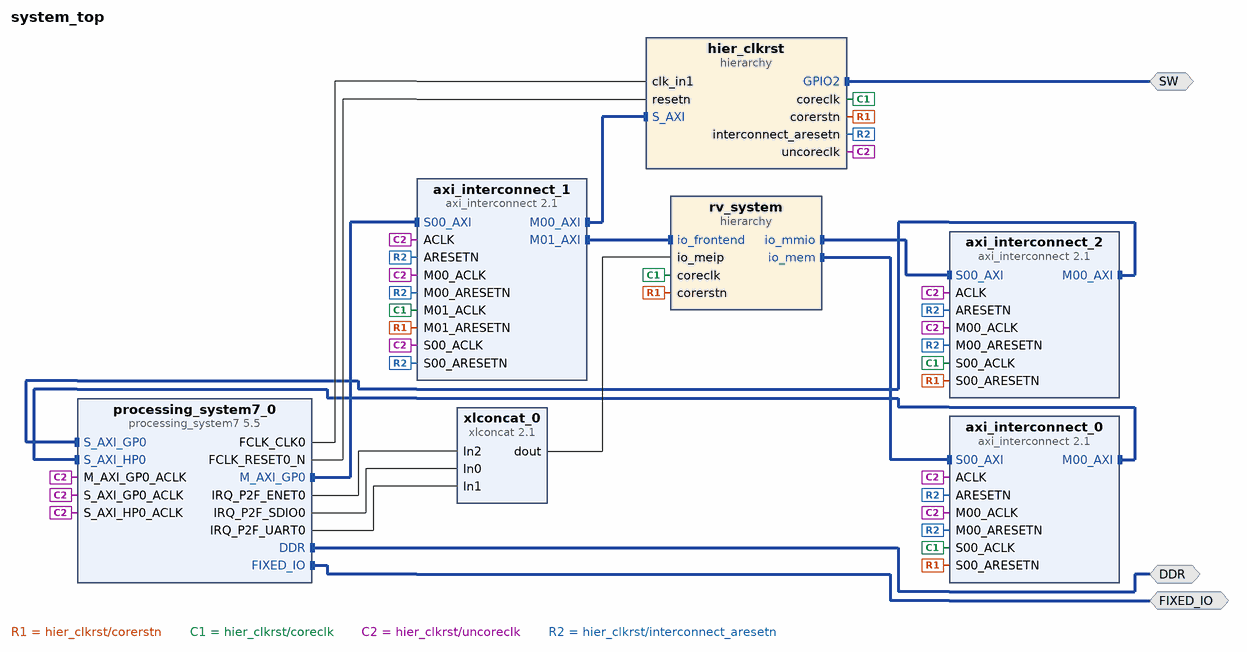
[diagram p0: block diagram of the top level]
# Vivado block design system_top, xc7z020clg400-1, Vivado 2020.2
create_bd_design system_top

create_bd_intf_port -mode Master -vlnv xilinx.com:interface:ddrx_rtl:1.0 DDR
create_bd_intf_port -mode Master -vlnv xilinx.com:display_processing_system7:fixedio_rtl:1.0 FIXED_IO
create_bd_intf_port -mode Master -vlnv xilinx.com:interface:gpio_rtl:1.0 SW

create_bd_cell -type ip -vlnv xilinx.com:ip:axi_interconnect:2.1 axi_interconnect_0
set_property -dict {CONFIG.NUM_MI 1 CONFIG.NUM_SI 1} [get_bd_cells axi_interconnect_0]
create_bd_cell -type ip -vlnv xilinx.com:ip:axi_interconnect:2.1 axi_interconnect_1
set_property -dict {CONFIG.NUM_MI 2} [get_bd_cells axi_interconnect_1]
create_bd_cell -type ip -vlnv xilinx.com:ip:axi_interconnect:2.1 axi_interconnect_2
set_property -dict {CONFIG.NUM_MI 1 CONFIG.NUM_SI 1} [get_bd_cells axi_interconnect_2]
create_bd_cell -type hier hier_clkrst
create_bd_cell -type ip -vlnv xilinx.com:ip:processing_system7:5.5 processing_system7_0
set_property -dict [list \
  CONFIG.PCW_APU_PERIPHERAL_FREQMHZ 650 \
  CONFIG.PCW_CRYSTAL_PERIPHERAL_FREQMHZ 50 \
  CONFIG.PCW_ENET0_ENET0_IO {MIO 16 .. 27} \
  CONFIG.PCW_ENET0_GRP_MDIO_ENABLE 1 \
  CONFIG.PCW_ENET0_GRP_MDIO_IO {MIO 52 .. 53} \
  CONFIG.PCW_ENET0_PERIPHERAL_ENABLE 1 \
  CONFIG.PCW_ENET0_RESET_ENABLE 1 \
  CONFIG.PCW_ENET0_RESET_IO {MIO 9} \
  CONFIG.PCW_ENET_RESET_ENABLE 1 \
  CONFIG.PCW_ENET_RESET_SELECT {Share reset pin} \
  CONFIG.PCW_FPGA0_PERIPHERAL_FREQMHZ 100 \
  CONFIG.PCW_FPGA1_PERIPHERAL_FREQMHZ 50 \
  CONFIG.PCW_GPIO_MIO_GPIO_ENABLE 1 \
  CONFIG.PCW_GPIO_MIO_GPIO_IO MIO \
  CONFIG.PCW_I2C_RESET_ENABLE 1 \
  CONFIG.PCW_M_AXI_GP0_ENABLE_STATIC_REMAP 1 \
  CONFIG.PCW_M_AXI_GP0_THREAD_ID_WIDTH 6 \
  CONFIG.PCW_P2F_ENET0_INTR 1 \
  CONFIG.PCW_P2F_SDIO0_INTR 1 \
  CONFIG.PCW_P2F_UART0_INTR 1 \
  CONFIG.PCW_PERIPHERAL_BOARD_PRESET part0 \
  CONFIG.PCW_PRESET_BANK1_VOLTAGE {LVCMOS 1.8V} \
  CONFIG.PCW_QSPI_GRP_FBCLK_ENABLE 1 \
  CONFIG.PCW_QSPI_GRP_FBCLK_IO {MIO 8} \
  CONFIG.PCW_QSPI_GRP_SINGLE_SS_ENABLE 1 \
  CONFIG.PCW_QSPI_GRP_SINGLE_SS_IO {MIO 1 .. 6} \
  CONFIG.PCW_QSPI_PERIPHERAL_ENABLE 1 \
  CONFIG.PCW_QSPI_QSPI_IO {MIO 1 .. 6} \
  CONFIG.PCW_SD0_GRP_CD_ENABLE 1 \
  CONFIG.PCW_SD0_GRP_CD_IO {MIO 47} \
  CONFIG.PCW_SD0_GRP_WP_ENABLE 0 \
  CONFIG.PCW_SD0_PERIPHERAL_ENABLE 1 \
  CONFIG.PCW_SD0_SD0_IO {MIO 40 .. 45} \
  CONFIG.PCW_SDIO_PERIPHERAL_FREQMHZ 50 \
  CONFIG.PCW_SINGLE_QSPI_DATA_MODE x4 \
  CONFIG.PCW_UART0_PERIPHERAL_ENABLE 1 \
  CONFIG.PCW_UART0_UART0_IO {MIO 14 .. 15} \
  CONFIG.PCW_UART1_PERIPHERAL_ENABLE 0 \
  CONFIG.PCW_UART_PERIPHERAL_FREQMHZ 100 \
  CONFIG.PCW_UIPARAM_DDR_BUS_WIDTH {16 Bit} \
  CONFIG.PCW_UIPARAM_DDR_FREQ_MHZ 525 \
  CONFIG.PCW_UIPARAM_DDR_PARTNO {MT41J256M16 RE-125} \
  CONFIG.PCW_USB0_PERIPHERAL_ENABLE 1 \
  CONFIG.PCW_USB0_RESET_ENABLE 1 \
  CONFIG.PCW_USB0_RESET_IO {MIO 46} \
  CONFIG.PCW_USB0_USB0_IO {MIO 28 .. 39} \
  CONFIG.PCW_USB_RESET_ENABLE 1 \
  CONFIG.PCW_USB_RESET_SELECT {Share reset pin} \
  CONFIG.PCW_USE_EXPANDED_IOP 1 \
  CONFIG.PCW_USE_FABRIC_INTERRUPT 1 \
  CONFIG.PCW_USE_PS_SLCR_REGISTERS 1 \
  CONFIG.PCW_USE_S_AXI_GP0 1 \
  CONFIG.PCW_USE_S_AXI_HP0 1 \
] [get_bd_cells processing_system7_0]
# 496 more settings of processing_system7_0 are not shown: defaults, MIO pin electricals, DDR timing, and values the tool derives
create_bd_cell -type hier rv_system
create_bd_cell -type ip -vlnv xilinx.com:ip:xlconcat:2.1 xlconcat_0
set_property -dict {CONFIG.NUM_PORTS 3} [get_bd_cells xlconcat_0]

# ---- hierarchy /hier_clkrst ----
current_bd_instance /hier_clkrst
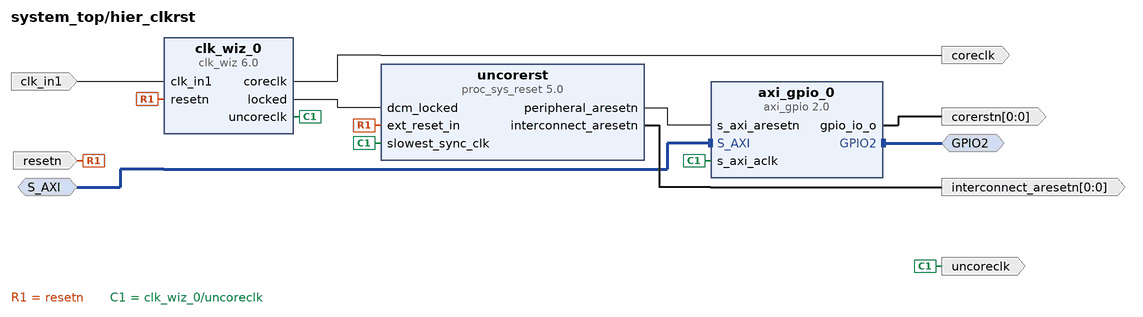
[diagram p1: block diagram inside /hier_clkrst]
create_bd_intf_pin -mode Master -vlnv xilinx.com:interface:gpio_rtl:1.0 GPIO2
create_bd_intf_pin -mode Slave -vlnv xilinx.com:interface:aximm_rtl:1.0 S_AXI
create_bd_pin -dir I -type clk clk_in1
create_bd_pin -dir O -type clk coreclk
create_bd_pin -dir O -from 0 -to 0 corerstn
create_bd_pin -dir O -from 0 -to 0 -type rst interconnect_aresetn
create_bd_pin -dir I -type rst resetn
create_bd_pin -dir O -type clk uncoreclk

create_bd_cell -type ip -vlnv xilinx.com:ip:axi_gpio:2.0 axi_gpio_0
set_property -dict {CONFIG.C_ALL_OUTPUTS 1 CONFIG.C_GPIO_WIDTH 1 CONFIG.GPIO2_BOARD_INTERFACE sws_2bits} [get_bd_cells axi_gpio_0]
create_bd_cell -type ip -vlnv xilinx.com:ip:clk_wiz:6.0 clk_wiz_0
set_property -dict [list \
  CONFIG.CLKIN1_JITTER_PS 100.0 \
  CONFIG.CLKOUT1_JITTER 153.276 \
  CONFIG.CLKOUT1_PHASE_ERROR 105.461 \
  CONFIG.CLKOUT1_REQUESTED_OUT_FREQ 60.000 \
  CONFIG.CLKOUT2_JITTER 137.681 \
  CONFIG.CLKOUT2_PHASE_ERROR 105.461 \
  CONFIG.CLKOUT2_REQUESTED_OUT_FREQ 100.000 \
  CONFIG.CLKOUT2_USED true \
  CONFIG.CLKOUT3_JITTER 159.475 \
  CONFIG.CLKOUT3_PHASE_ERROR 105.461 \
  CONFIG.CLKOUT3_REQUESTED_OUT_FREQ 100.000 \
  CONFIG.CLKOUT3_USED false \
  CONFIG.CLKOUT4_REQUESTED_OUT_FREQ 100.000 \
  CONFIG.CLKOUT4_USED false \
  CONFIG.CLK_OUT1_PORT coreclk \
  CONFIG.CLK_OUT2_PORT uncoreclk \
  CONFIG.CLK_OUT3_PORT clk_out3 \
  CONFIG.MMCM_CLKFBOUT_MULT_F 9.000 \
  CONFIG.MMCM_CLKIN1_PERIOD 10.000 \
  CONFIG.MMCM_CLKIN2_PERIOD 10.000 \
  CONFIG.MMCM_CLKOUT0_DIVIDE_F 15.000 \
  CONFIG.MMCM_CLKOUT1_DIVIDE 9 \
  CONFIG.MMCM_CLKOUT2_DIVIDE 1 \
  CONFIG.MMCM_CLKOUT3_DIVIDE 1 \
  CONFIG.MMCM_DIVCLK_DIVIDE 1 \
  CONFIG.NUM_OUT_CLKS 2 \
  CONFIG.RESET_PORT resetn \
  CONFIG.RESET_TYPE ACTIVE_LOW \
] [get_bd_cells clk_wiz_0]
create_bd_cell -type ip -vlnv xilinx.com:ip:proc_sys_reset:5.0 uncorerst

# ---- hierarchy /rv_system ----
current_bd_instance /rv_system
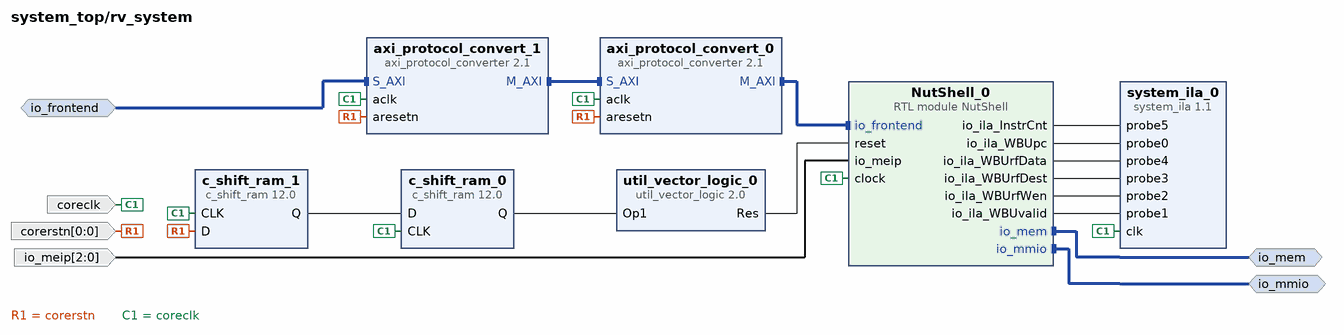
[diagram p2: block diagram inside /rv_system]
create_bd_intf_pin -mode Slave -vlnv xilinx.com:interface:aximm_rtl:1.0 io_frontend
create_bd_intf_pin -mode Master -vlnv xilinx.com:interface:aximm_rtl:1.0 io_mem
create_bd_intf_pin -mode Master -vlnv xilinx.com:interface:aximm_rtl:1.0 io_mmio
create_bd_pin -dir I -type clk coreclk
create_bd_pin -dir I -from 0 -to 0 -type data corerstn
create_bd_pin -dir I -from 2 -to 0 io_meip

create_bd_cell -type module -reference NutShell NutShell_0
create_bd_cell -type ip -vlnv xilinx.com:ip:axi_protocol_converter:2.1 axi_protocol_convert_0
set_property -dict [list \
  CONFIG.MI_PROTOCOL AXI4 \
  CONFIG.SI_PROTOCOL AXI4LITE \
  CONFIG.TRANSLATION_MODE 2 \
] [get_bd_cells axi_protocol_convert_0]
create_bd_cell -type ip -vlnv xilinx.com:ip:axi_protocol_converter:2.1 axi_protocol_convert_1
set_property -dict {CONFIG.MI_PROTOCOL AXI4LITE CONFIG.SI_PROTOCOL AXI4} [get_bd_cells axi_protocol_convert_1]
create_bd_cell -type ip -vlnv xilinx.com:ip:c_shift_ram:12.0 c_shift_ram_0
set_property -dict {CONFIG.AsyncInitVal 0 CONFIG.DefaultData 0 CONFIG.Depth 1 CONFIG.Width 1} [get_bd_cells c_shift_ram_0]
create_bd_cell -type ip -vlnv xilinx.com:ip:c_shift_ram:12.0 c_shift_ram_1
set_property -dict {CONFIG.AsyncInitVal 0 CONFIG.DefaultData 0 CONFIG.Depth 1 CONFIG.Width 1} [get_bd_cells c_shift_ram_1]
create_bd_cell -type ip -vlnv xilinx.com:ip:system_ila:1.1 system_ila_0
set_property -dict {CONFIG.C_MON_TYPE NATIVE CONFIG.C_NUM_MONITOR_SLOTS 1 CONFIG.C_NUM_OF_PROBES 6} [get_bd_cells system_ila_0]
create_bd_cell -type ip -vlnv xilinx.com:ip:util_vector_logic:2.0 util_vector_logic_0
set_property -dict {CONFIG.C_OPERATION not CONFIG.C_SIZE 1} [get_bd_cells util_vector_logic_0]

# ---- connections ----

current_bd_instance /hier_clkrst
connect_bd_intf_net [get_bd_intf_pins GPIO2] [get_bd_intf_pins axi_gpio_0/GPIO2]
connect_bd_intf_net -intf_net axi_crossbar_0_M00_AXI [get_bd_intf_pins S_AXI] [get_bd_intf_pins axi_gpio_0/S_AXI]
connect_bd_net -net armv7_processing_system_FCLK_RESET0_N [get_bd_pins resetn] [get_bd_pins clk_wiz_0/resetn] [get_bd_pins uncorerst/ext_reset_in]
connect_bd_net [get_bd_pins axi_gpio_0/gpio_io_o] [get_bd_pins corerstn]
connect_bd_net [get_bd_pins clk_wiz_0/coreclk] [get_bd_pins coreclk]
connect_bd_net [get_bd_pins clk_wiz_0/locked] [get_bd_pins uncorerst/dcm_locked]
connect_bd_net [get_bd_pins clk_wiz_0/uncoreclk] [get_bd_pins uncoreclk] [get_bd_pins axi_gpio_0/s_axi_aclk] [get_bd_pins uncorerst/slowest_sync_clk]
connect_bd_net -net proc_sys_reset_1_interconnect_aresetn [get_bd_pins uncorerst/interconnect_aresetn] [get_bd_pins interconnect_aresetn]
connect_bd_net -net proc_sys_reset_1_peripheral_aresetn [get_bd_pins uncorerst/peripheral_aresetn] [get_bd_pins axi_gpio_0/s_axi_aresetn]
connect_bd_net -net processing_system7_0_FCLK_CLK0 [get_bd_pins clk_in1] [get_bd_pins clk_wiz_0/clk_in1]

current_bd_instance /rv_system
connect_bd_intf_net [get_bd_intf_pins io_mem] [get_bd_intf_pins NutShell_0/io_mem]
connect_bd_intf_net [get_bd_intf_pins io_frontend] [get_bd_intf_pins axi_protocol_convert_1/S_AXI]
connect_bd_intf_net [get_bd_intf_pins axi_protocol_convert_0/S_AXI] [get_bd_intf_pins axi_protocol_convert_1/M_AXI]
connect_bd_intf_net [get_bd_intf_pins NutShell_0/io_frontend] [get_bd_intf_pins axi_protocol_convert_0/M_AXI]
connect_bd_intf_net [get_bd_intf_pins io_mmio] [get_bd_intf_pins NutShell_0/io_mmio]
connect_bd_net [get_bd_pins NutShell_0/io_ila_InstrCnt] [get_bd_pins system_ila_0/probe5]
connect_bd_net [get_bd_pins NutShell_0/io_ila_WBUpc] [get_bd_pins system_ila_0/probe0]
connect_bd_net [get_bd_pins NutShell_0/io_ila_WBUrfData] [get_bd_pins system_ila_0/probe4]
connect_bd_net [get_bd_pins NutShell_0/io_ila_WBUrfDest] [get_bd_pins system_ila_0/probe3]
connect_bd_net [get_bd_pins NutShell_0/io_ila_WBUrfWen] [get_bd_pins system_ila_0/probe2]
connect_bd_net [get_bd_pins NutShell_0/io_ila_WBUvalid] [get_bd_pins system_ila_0/probe1]
connect_bd_net -net axi_gpio_0_gpio_io_o [get_bd_pins corerstn] \
  [get_bd_pins axi_protocol_convert_0/aresetn] [get_bd_pins axi_protocol_convert_1/aresetn] [get_bd_pins c_shift_ram_1/D]
connect_bd_net [get_bd_pins c_shift_ram_0/Q] [get_bd_pins util_vector_logic_0/Op1]
connect_bd_net [get_bd_pins c_shift_ram_1/Q] [get_bd_pins c_shift_ram_0/D]
connect_bd_net -net clk_wiz_0_coreclk [get_bd_pins coreclk] \
  [get_bd_pins NutShell_0/clock] [get_bd_pins axi_protocol_convert_0/aclk] [get_bd_pins axi_protocol_convert_1/aclk] \
  [get_bd_pins c_shift_ram_0/CLK] [get_bd_pins c_shift_ram_1/CLK] [get_bd_pins system_ila_0/clk]
connect_bd_net [get_bd_pins io_meip] [get_bd_pins NutShell_0/io_meip]
connect_bd_net [get_bd_pins util_vector_logic_0/Res] [get_bd_pins NutShell_0/reset]

current_bd_instance /
connect_bd_intf_net [get_bd_intf_ports DDR] [get_bd_intf_pins processing_system7_0/DDR]
connect_bd_intf_net [get_bd_intf_ports SW] [get_bd_intf_pins hier_clkrst/GPIO2]
connect_bd_intf_net [get_bd_intf_pins axi_interconnect_2/M00_AXI] [get_bd_intf_pins processing_system7_0/S_AXI_GP0]
connect_bd_intf_net [get_bd_intf_pins axi_interconnect_1/M01_AXI] [get_bd_intf_pins rv_system/io_frontend]
connect_bd_intf_net [get_bd_intf_pins axi_interconnect_1/M00_AXI] [get_bd_intf_pins hier_clkrst/S_AXI]
connect_bd_intf_net [get_bd_intf_pins axi_interconnect_0/M00_AXI] [get_bd_intf_pins processing_system7_0/S_AXI_HP0]
connect_bd_intf_net [get_bd_intf_pins axi_interconnect_2/S00_AXI] [get_bd_intf_pins rv_system/io_mmio]
connect_bd_intf_net [get_bd_intf_pins axi_interconnect_1/S00_AXI] [get_bd_intf_pins processing_system7_0/M_AXI_GP0]
connect_bd_intf_net -intf_net NutShell_0_io_mem [get_bd_intf_pins axi_interconnect_0/S00_AXI] [get_bd_intf_pins rv_system/io_mem]
connect_bd_intf_net [get_bd_intf_ports FIXED_IO] [get_bd_intf_pins processing_system7_0/FIXED_IO]
connect_bd_net -net axi_gpio_0_gpio_io_o [get_bd_pins hier_clkrst/corerstn] \
  [get_bd_pins axi_interconnect_0/S00_ARESETN] [get_bd_pins axi_interconnect_1/M01_ARESETN] \
  [get_bd_pins axi_interconnect_2/S00_ARESETN] [get_bd_pins rv_system/corerstn]
connect_bd_net -net clk_wiz_0_coreclk [get_bd_pins hier_clkrst/coreclk] \
  [get_bd_pins axi_interconnect_0/S00_ACLK] [get_bd_pins axi_interconnect_1/M01_ACLK] \
  [get_bd_pins axi_interconnect_2/S00_ACLK] [get_bd_pins rv_system/coreclk]
connect_bd_net -net clk_wiz_0_uncoreclk [get_bd_pins hier_clkrst/uncoreclk] \
  [get_bd_pins axi_interconnect_0/ACLK] [get_bd_pins axi_interconnect_0/M00_ACLK] [get_bd_pins axi_interconnect_1/ACLK] \
  [get_bd_pins axi_interconnect_1/M00_ACLK] [get_bd_pins axi_interconnect_1/S00_ACLK] [get_bd_pins axi_interconnect_2/ACLK] \
  [get_bd_pins axi_interconnect_2/M00_ACLK] [get_bd_pins processing_system7_0/M_AXI_GP0_ACLK] \
  [get_bd_pins processing_system7_0/S_AXI_GP0_ACLK] [get_bd_pins processing_system7_0/S_AXI_HP0_ACLK]
connect_bd_net -net proc_sys_reset_1_interconnect_aresetn [get_bd_pins hier_clkrst/interconnect_aresetn] \
  [get_bd_pins axi_interconnect_0/ARESETN] [get_bd_pins axi_interconnect_0/M00_ARESETN] \
  [get_bd_pins axi_interconnect_1/ARESETN] [get_bd_pins axi_interconnect_1/M00_ARESETN] \
  [get_bd_pins axi_interconnect_1/S00_ARESETN] [get_bd_pins axi_interconnect_2/ARESETN] \
  [get_bd_pins axi_interconnect_2/M00_ARESETN]
connect_bd_net [get_bd_pins processing_system7_0/FCLK_CLK0] [get_bd_pins hier_clkrst/clk_in1]
connect_bd_net [get_bd_pins processing_system7_0/IRQ_P2F_ENET0] [get_bd_pins xlconcat_0/In2]
connect_bd_net [get_bd_pins processing_system7_0/IRQ_P2F_SDIO0] [get_bd_pins xlconcat_0/In0]
connect_bd_net [get_bd_pins processing_system7_0/IRQ_P2F_UART0] [get_bd_pins xlconcat_0/In1]
connect_bd_net -net resetn_1 [get_bd_pins processing_system7_0/FCLK_RESET0_N] [get_bd_pins hier_clkrst/resetn]
connect_bd_net [get_bd_pins xlconcat_0/dout] [get_bd_pins rv_system/io_meip]

# ---- address map ----
assign_bd_address -offset 0x40000000 -range 4K -target_address_space [get_bd_addr_spaces processing_system7_0/Data] [get_bd_addr_segs hier_clkrst/axi_gpio_0/S_AXI/Reg]
assign_bd_address -offset 0x60000000 -range 512M -target_address_space [get_bd_addr_spaces processing_system7_0/Data] [get_bd_addr_segs rv_system/NutShell_0/io_frontend/reg0]
assign_bd_address -offset 0x10000000 -range 256M -target_address_space [get_bd_addr_spaces rv_system/NutShell_0/io_mem] [get_bd_addr_segs processing_system7_0/S_AXI_HP0/HP0_DDR_LOWOCM]
assign_bd_address -offset 0xE0000000 -range 4K -target_address_space [get_bd_addr_spaces rv_system/NutShell_0/io_mmio] [get_bd_addr_segs processing_system7_0/S_AXI_GP0/GP0_UART0]
assign_bd_address -offset 0xE000B000 -range 4K -target_address_space [get_bd_addr_spaces rv_system/NutShell_0/io_mmio] [get_bd_addr_segs processing_system7_0/S_AXI_GP0/GP0_ENET0]
assign_bd_address -offset 0xE0100000 -range 4K -target_address_space [get_bd_addr_spaces rv_system/NutShell_0/io_mmio] [get_bd_addr_segs processing_system7_0/S_AXI_GP0/GP0_SDIO0]
assign_bd_address -offset 0xF8000000 -range 64K -target_address_space [get_bd_addr_spaces rv_system/NutShell_0/io_mmio] [get_bd_addr_segs processing_system7_0/S_AXI_GP0/GP0_PS_SLCR_REGS]

validate_bd_design
save_bd_design
